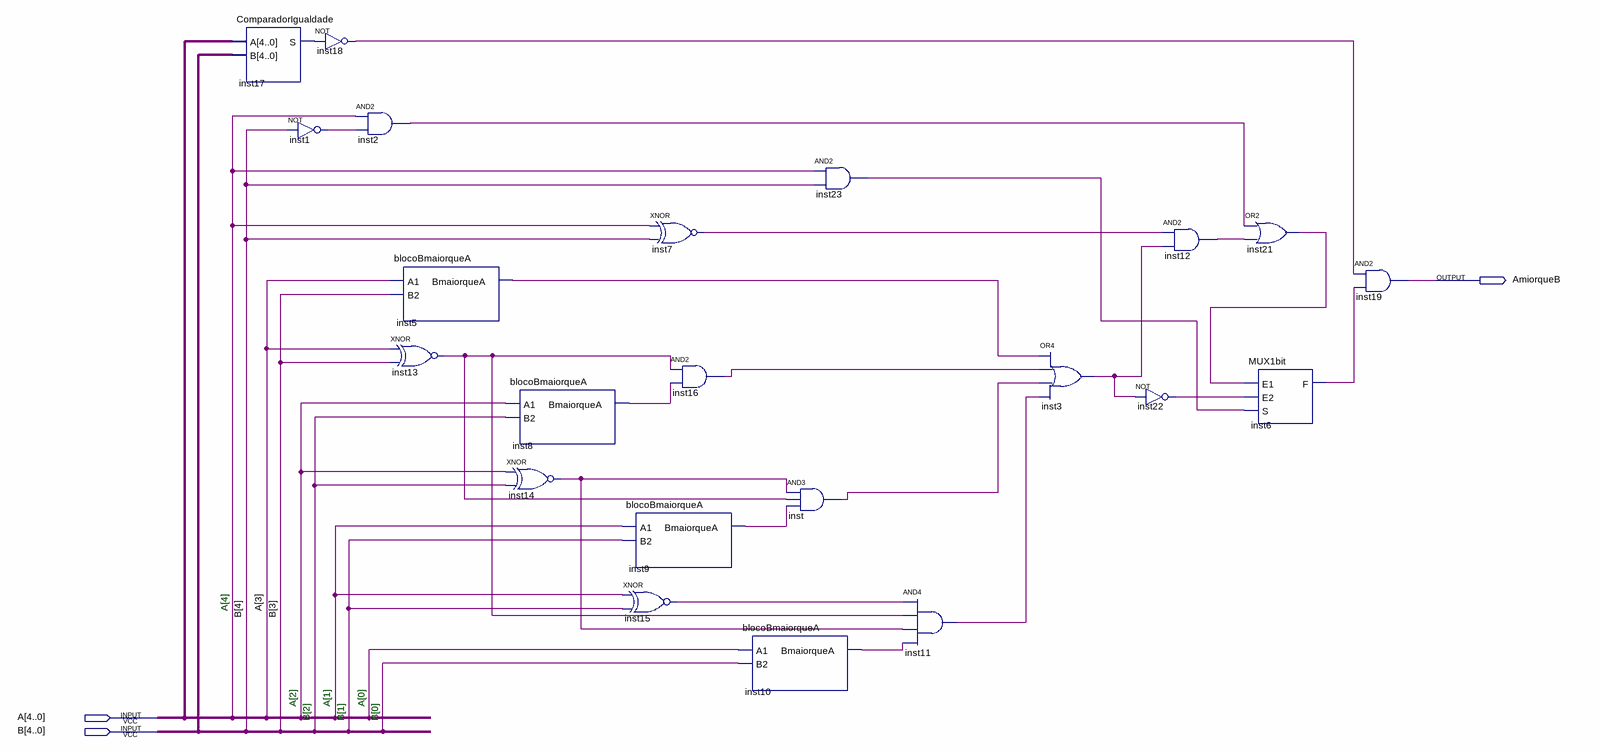
[diagram p0: schematic sheet]
// Quartus schematic ComparadorBmaiorqueA.bdf as structural Verilog: 22 symbols, 3 pins
module ComparadorBmaiorqueA (
  input  [4:0] A,
  input  [4:0] B,
  output AmiorqueB
);

  wire inst1_out, inst2_out, inst3_out, inst5_bmaiorquea, inst6_f, inst7_out, inst8_bmaiorquea,
       inst9_bmaiorquea, inst10_bmaiorquea, inst11_out, inst12_out, inst13_out, inst14_out, inst15_out,
       inst16_out, inst17_s, inst18_out, inst21_out, inst22_out, inst23_out, inst_out;

  ComparadorIgualdade inst17 (.A(A), .B(B), .S(inst17_s));
  not inst1 (inst1_out, B[4]);
  not inst18 (inst18_out, inst17_s);
  and inst2 (inst2_out, A[4], inst1_out);
  blocoBmaiorqueA inst5 (.A1(A[3]), .B2(B[3]), .BmaiorqueA(inst5_bmaiorquea));
  xnor inst13 (inst13_out, A[3], B[3]);
  blocoBmaiorqueA inst8 (.A1(A[2]), .B2(B[2]), .BmaiorqueA(inst8_bmaiorquea));
  xnor inst14 (inst14_out, A[2], B[2]);
  blocoBmaiorqueA inst9 (.A1(A[1]), .B2(B[1]), .BmaiorqueA(inst9_bmaiorquea));
  xnor inst15 (inst15_out, A[1], B[1]);
  xnor inst7 (inst7_out, A[4], B[4]);
  and inst16 (inst16_out, inst13_out, inst8_bmaiorquea);
  blocoBmaiorqueA inst10 (.A1(A[0]), .B2(B[0]), .BmaiorqueA(inst10_bmaiorquea));
  and inst (inst_out, inst14_out, inst13_out, inst9_bmaiorquea);
  and inst23 (inst23_out, A[4], B[4]);
  and inst11 (inst11_out, inst15_out, inst13_out, inst14_out, inst10_bmaiorquea);
  or inst3 (inst3_out, inst5_bmaiorquea, inst16_out, inst_out, inst11_out);
  and inst12 (inst12_out, inst7_out, inst3_out);
  not inst22 (inst22_out, inst3_out);
  or inst21 (inst21_out, inst2_out, inst12_out);
  MUX1bit inst6 (.E1(inst21_out), .E2(inst22_out), .S(inst23_out), .F(inst6_f));
  and inst19 (AmiorqueB, inst18_out, inst6_f);

  // Notes on the sheet:
  //   A[4]
  //   A[2]
  //   A[1]
  //   A[0]
  //   B[2]
  //   B[1]
  //   B[0]
endmodule
